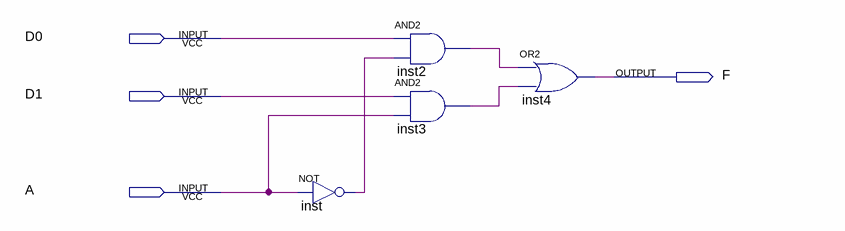
[diagram p0: schematic sheet]
// Quartus schematic Mux.bdf as structural Verilog: 4 symbols, 4 pins
module Mux (
  input  D0,
  input  D1,
  input  A,
  output F
);

  wire inst2_out, inst3_out, inst_out;

  not inst (inst_out, A);
  and inst2 (inst2_out, D0, inst_out);
  and inst3 (inst3_out, D1, A);
  or inst4 (F, inst2_out, inst3_out);
endmodule
